# EAGLE design rs232 (EAGLE 6.6.0)
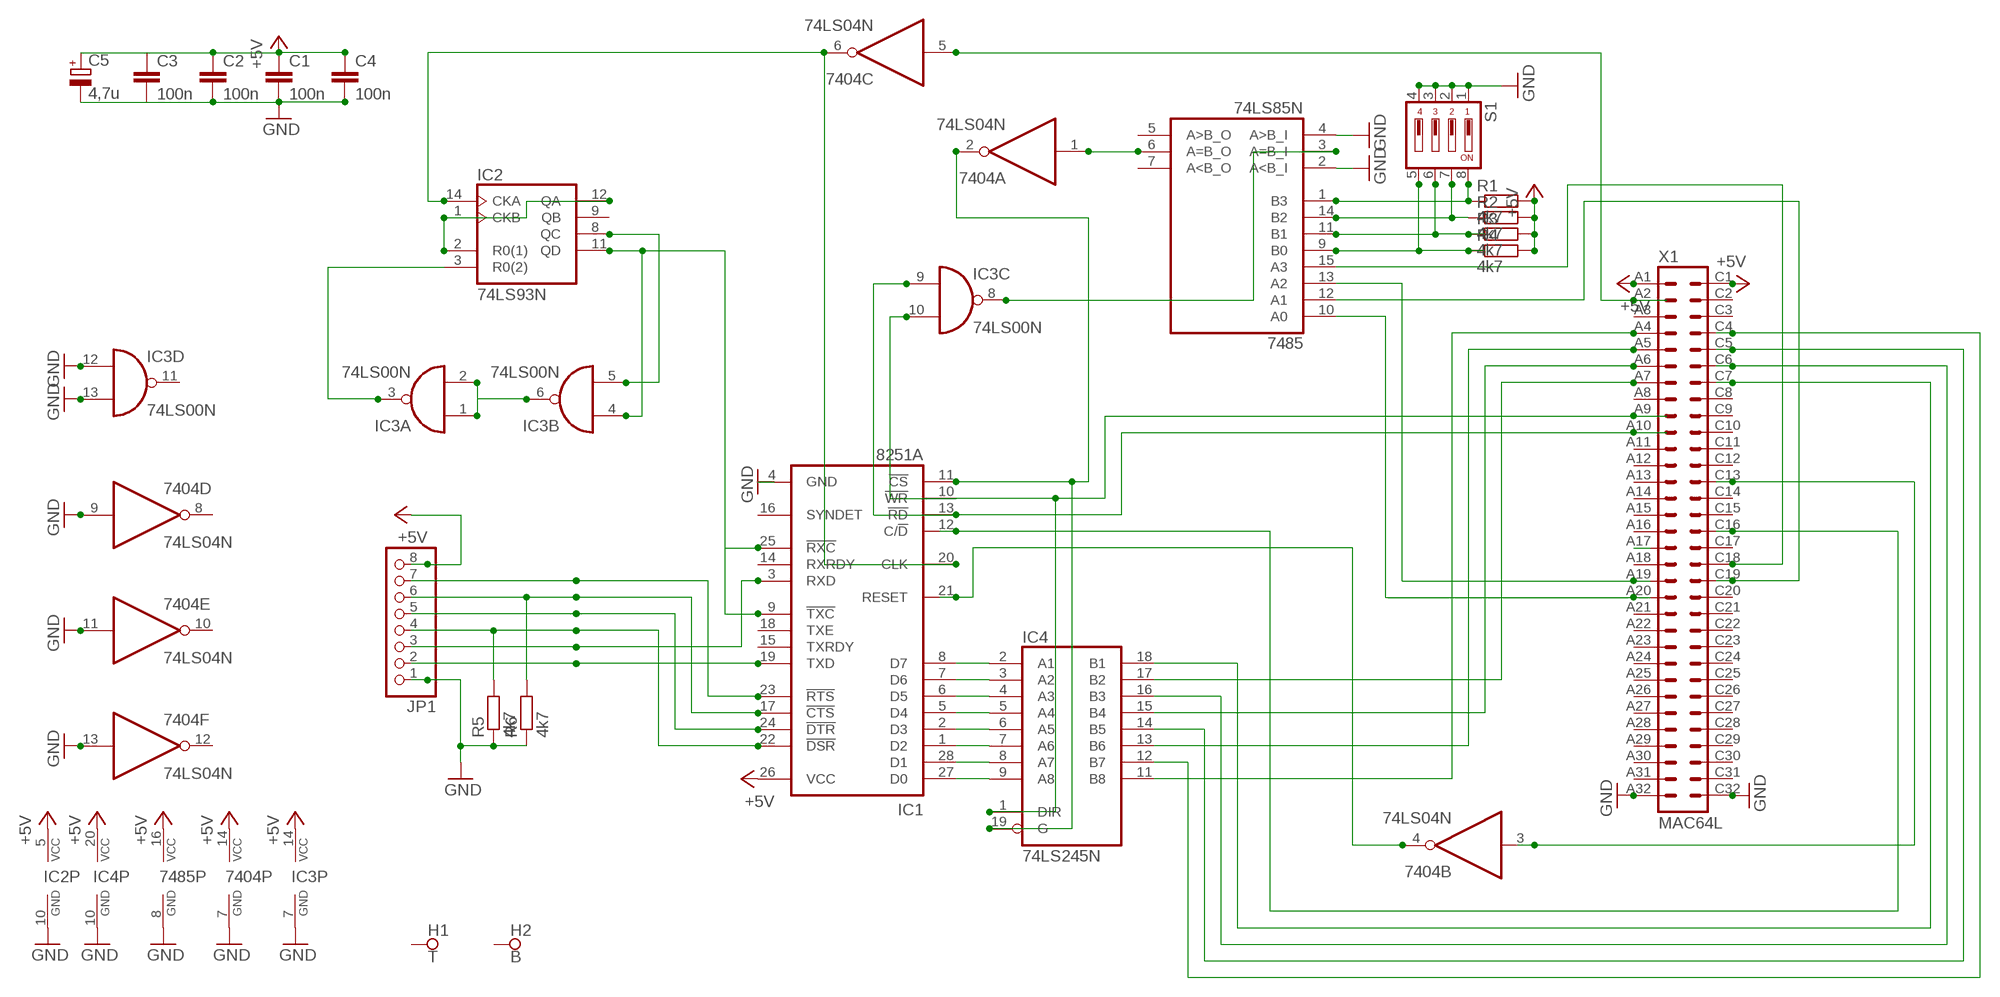
[diagram p0: schematic, sheet 1]

## Parts
7404  74LS04N  [DIL14]
7485  74LS85N  [DIL16]
C1  100n  C-EU025-025X050  [C025-025X050]
C2  100n  C-EU025-025X050  [C025-025X050]
C3  100n  C-EU025-025X050  [C025-025X050]
C4  100n  C-EU025-025X050  [C025-025X050]
C5  4,7u  CPOL-EUE2.5-5  [E2,5-5]
H1  T  SPECIAL_DRILL_0.1000  [PAD_0.1000]
H2  B  SPECIAL_DRILL_0.1000  [PAD_0.1000]
IC1  8251A  [DIL28-6]
IC2  74LS93N  [DIL14]
IC3  74LS00N  [DIL14]
IC4  74LS245N  [DIL20]
JP1  PINHD-1X8  [1X08]
R1  4k7  R-EU_0207/10  [0207/10]
R2  4k7  R-EU_0207/10  [0207/10]
R3  4k7  R-EU_0207/10  [0207/10]
R4  4k7  R-EU_0207/10  [0207/10]
R5  4k7  R-EU_0207/10  [0207/10]
R6  4k7  R-EU_0207/10  [0207/10]
S1  DS04  [DS-04]
X1  MAC64L  [MAC64L]

## Nets
+5V: 7404.14(P:VCC) 7485.16(VCC) C1.1 C2.1 C3.1 C4.1 C5.+ IC1.26(VCC) IC2.5(VCC) IC3.14(P:VCC) IC4.20(VCC) JP1.8 R1.2 R2.2 R3.2 R4.2 X1.A1 X1.C1
-A=B: 7485.3(A=B_I) IC3.8(C:O)
-CLK: 7404.6(C:O) IC1.20(CLK) IC2.14(CKA)
-D0: IC1.27(D0) IC4.9(A8)
-D1: IC1.28(D1) IC4.8(A7)
-D2: IC1.1(D2) IC4.7(A6)
-D3: IC1.2(D3) IC4.6(A5)
-D4: IC1.5(D4) IC4.5(A4)
-D5: IC1.6(D5) IC4.4(A3)
-D6: IC1.7(D6) IC4.3(A2)
-D7: IC1.8(D7) IC4.2(A1)
/CS: 7404.2(A:O) IC1.11(!CS) IC4.19(G)
/CTS: IC1.17(!CTS) JP1.6 R6.2
/DSR: IC1.22(!DSR) JP1.4 R5.2
/DTR: IC1.24(!DTR) JP1.5
/RES: 7404.3(B:I) X1.C13
/RTS: IC1.23(!RTS) JP1.7
A0: IC1.12(C/!D) X1.C16
A1: X1.A17
A4: 7485.15(A3) X1.C18
A5: 7485.13(A2) X1.A19
A6: 7485.12(A1) X1.C19
A7: 7485.10(A0) X1.A20
A=B: 7404.1(A:I) 7485.6(A=B_O)
CLK: 7404.5(C:I) X1.A2
D0: IC4.11(B8) X1.A4
D1: IC4.12(B7) X1.C4
D2: IC4.13(B6) X1.A5
D3: IC4.14(B5) X1.C5
D4: IC4.15(B4) X1.A6
D5: IC4.16(B3) X1.C6
D6: IC4.17(B2) X1.A7
D7: IC4.18(B1) X1.C7
GND: 7404.7(P:GND) 7404.9(D:I) 7404.11(E:I) 7404.13(F:I) 7485.2(A<B_I) 7485.4(A>B_I) 7485.8(GND) C1.2 C2.2 C3.2 C4.2 C5.- IC1.4(GND) IC2.10(GND) IC3.7(P:GND) IC3.12(D:I0) IC3.13(D:I1) IC4.10(GND) JP1.1 R5.1 R6.1 S1.1 S1.2 S1.3 S1.4 X1.A32 X1.C32
IOR: IC1.13(!RD) IC3.9(C:I0) X1.A10
IOW: IC1.10(!WR) IC3.10(C:I1) IC4.1(DIR) X1.A9
N$8: IC3.1(A:I0) IC3.2(A:I1) IC3.6(B:O)
N$9: IC2.3(R0(2)) IC3.3(A:O)
N$10: IC2.8(QC) IC3.5(B:I1)
N$19: IC2.1(CKB) IC2.2(R0(1)) IC2.12(QA)
R1: 7485.1(B3) R1.1 S1.8
R2: 7485.14(B2) R2.1 S1.7
R3: 7485.11(B1) R3.1 S1.6
R4: 7485.9(B0) R4.1 S1.5
RES: 7404.4(B:O) IC1.21(RESET)
RTXC: IC1.9(!TXC) IC1.25(!RXC) IC2.11(QD) IC3.4(B:I0)
RXD: IC1.3(RXD) JP1.3
TXD: IC1.19(TXD) JP1.2
Unconnected: 7404.8(D:O) 7404.10(E:O) 7404.12(F:O) 7485.5(A>B_O) 7485.7(A<B_O) H1.1 H2.1 IC1.14(RXRDY) IC1.15(TXRDY) IC1.16(SYNDET) IC1.18(TXE) IC2.9(QB) IC3.11(D:O) X1.A3 X1.A8 X1.A11 X1.A12 X1.A13 X1.A14 X1.A15 X1.A16 X1.A18 X1.A21 X1.A22 X1.A23 X1.A24 X1.A25 X1.A26 X1.A27 X1.A28 X1.A29 X1.A30 X1.A31 X1.C2 X1.C3 X1.C8 X1.C9 X1.C10 X1.C11 X1.C12 X1.C14 X1.C15 X1.C17 X1.C20 X1.C21 X1.C22 X1.C23 X1.C24 X1.C25 X1.C26 X1.C27 X1.C28 X1.C29 X1.C30 X1.C31

## Library data of the parts
7404 = 74xx-eu:74*04: Hex INVERTER
7485 = 74xx-eu:74*85: 4-bit magnitude COMPARATOR
C1-C4 = rcl:C-EU: CAPACITOR, European symbol
C5 = rcl:CPOL-EU: POLARIZED CAPACITOR, European symbol
H1 H2 = special-drill:SPECIAL_DRILL_: Special drills
IC1 = micro-intel:8251A: Universal Syncronous/Asynchronous Receiver/Transmitter (USART) Source: http://www.alldatasheet.com/datasheet-pdf/pdf/INTEL/8251A.html; OC_FARNELL: unknown; OC_NEWARK: unknown
IC2 = 74xx-eu:74*93: Decade, divide by twelve and binary COUNTER
IC3 = 74xx-eu:74*00: Quad 2-input NAND gate
IC4 = 74xx-eu:74*245: Octal BUS TRANSCEIVER, 3-state
JP1 = pinhead:PINHD-1X8: PIN HEADER
R1-R6 = rcl:R-EU_: RESISTOR, European symbol
S1 = switch-dil:DS04: DIL/CODE SWITCH; OC_FARNELL: 9471570; OC_NEWARK: unknown
X1 = con-vg:MAC64L: CONNECTOR male, 64 pins, block, type C, rows AC, grid 5.08 mm

## Board
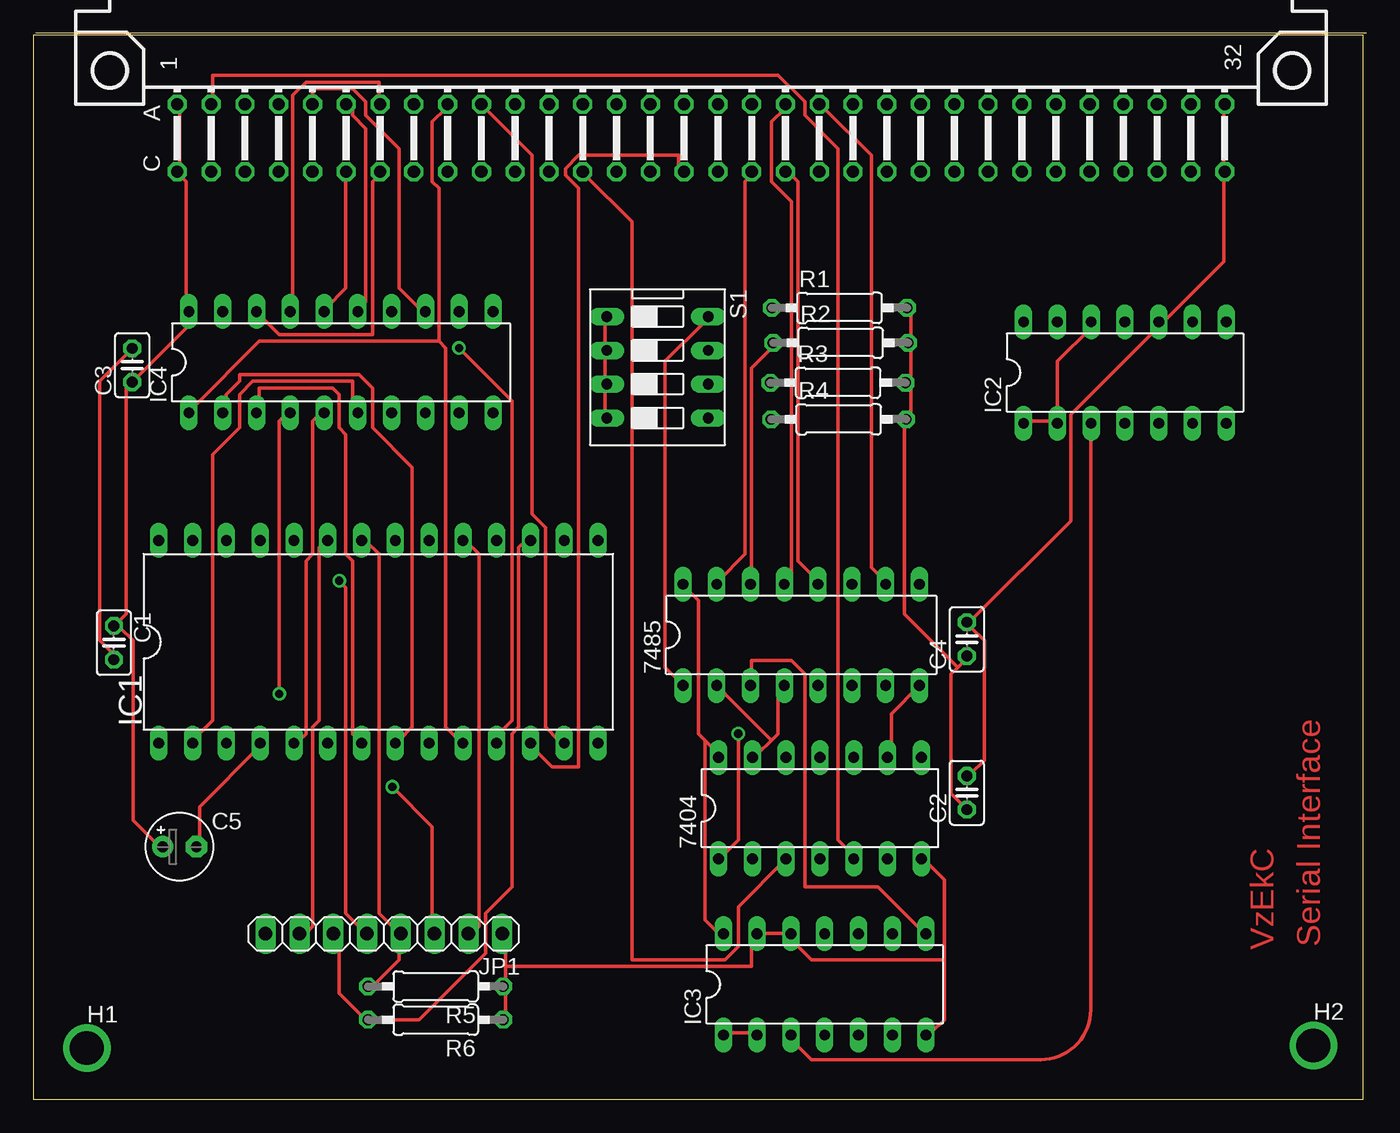
[diagram p1: board, top side]
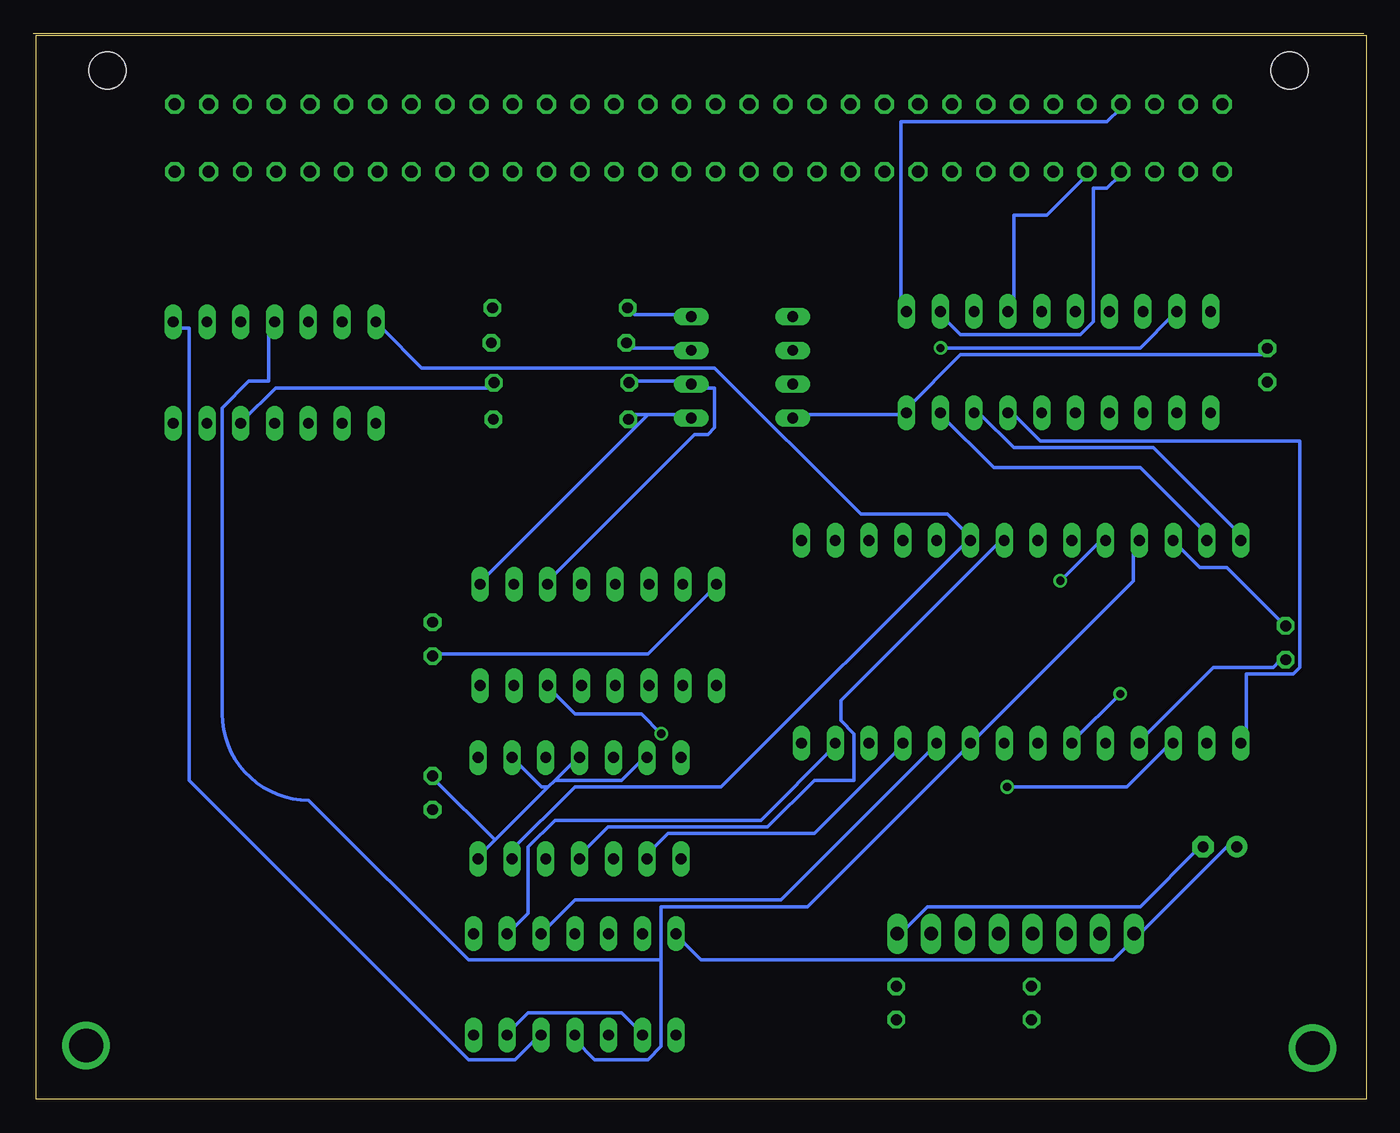
[diagram p2: board, bottom side, seen from below]

Size 100 x 80 mm. Coordinates in mm from the lower left corner, seen from the top.
Outline: 0,0 100,0 100,80 0,80 0,0
Copper layers (1*16): Top 0.035mm / dielectric 1.5mm / Bottom 0.035mm
Design rules "default": minimum track width 10mil, minimum drill 24mil, track to track 8mil, track to pad 8mil, pad to pad 8mil, via to via 8mil, smd to smd 8mil, copper to edge 40mil, drill to drill 8mil, minimum pad ring 10mil, minimum via ring 8mil, stop-mask expansion 4mil, vias tented up to drill 0mil, thermal gap 10mil

### Footprints (pad centres in the part's own frame; a part is rotated, then mirrored left to right if it is on the bottom)
DIL14 = drill 0.813 long: 1 -7.62,-3.81; 2 -5.08,-3.81; 3 -2.54,-3.81; 4 0,-3.81; 5 2.54,-3.81; 6 5.08,-3.81; 7 7.62,-3.81; 8 7.62,3.81; 9 5.08,3.81; 10 2.54,3.81; 11 0,3.81; 12 -2.54,3.81; 13 -5.08,3.81; 14 -7.62,3.81
DIL16 = drill 0.813 long: 1 -8.89,-3.81; 2 -6.35,-3.81; 3 -3.81,-3.81; 4 -1.27,-3.81; 5 1.27,-3.81; 6 3.81,-3.81; 7 6.35,-3.81; 8 8.89,-3.81; 9 8.89,3.81; 10 6.35,3.81; 11 3.81,3.81; 12 1.27,3.81; 13 -1.27,3.81; 14 -3.81,3.81; 15 -6.35,3.81; 16 -8.89,3.81
C025-025X050 = drill 0.813 octagon: 1 -1.27,0; 2 1.27,0
E2,5-5 = drill 0.813 pad 1.6: + -1.27,0 | drill 0.813 pad 1.6 octagon: - 1.27,0
PAD_0.1000 = drill 2.54 pad 2.54: 1 0,0
DIL28-6 = drill 0.813 long: 1 -16.51,-7.62; 2 -13.97,-7.62; 3 -11.43,-7.62; 4 -8.89,-7.62; 5 -6.35,-7.62; 6 -3.81,-7.62; 7 -1.27,-7.62; 8 1.27,-7.62; 9 3.81,-7.62; 10 6.35,-7.62; 11 8.89,-7.62; 12 11.43,-7.62; 13 13.97,-7.62; 14 16.51,-7.62; 15 16.51,7.62; 16 13.97,7.62; 17 11.43,7.62; 18 8.89,7.62; 19 6.35,7.62; 20 3.81,7.62; 21 1.27,7.62; 22 -1.27,7.62; 23 -3.81,7.62; 24 -6.35,7.62; 25 -8.89,7.62; 26 -11.43,7.62; 27 -13.97,7.62; 28 -16.51,7.62
DIL20 = drill 0.813 long: 1 -11.43,-3.81; 2 -8.89,-3.81; 3 -6.35,-3.81; 4 -3.81,-3.81; 5 -1.27,-3.81; 6 1.27,-3.81; 7 3.81,-3.81; 8 6.35,-3.81; 9 8.89,-3.81; 10 11.43,-3.81; 11 11.43,3.81; 12 8.89,3.81; 13 6.35,3.81; 14 3.81,3.81; 15 1.27,3.81; 16 -1.27,3.81; 17 -3.81,3.81; 18 -6.35,3.81; 19 -8.89,3.81; 20 -11.43,3.81
1X08 = drill 1.016 long: 1 -8.89,0; 2 -6.35,0; 3 -3.81,0; 4 -1.27,0; 5 1.27,0; 6 3.81,0; 7 6.35,0; 8 8.89,0
0207/10 = drill 0.813 octagon: 1 -5.08,0; 2 5.08,0
DS-04 = drill 0.813 long: 1 -3.81,-3.81; 2 -1.27,-3.81; 3 1.27,-3.81; 4 3.81,-3.81; 5 3.81,3.81; 6 1.27,3.81; 7 -1.27,3.81; 8 -3.81,3.81
MAC64L = drill 0.914 octagon: A1 -2.54,39.37; A2 -2.54,36.83; A3 -2.54,34.29; A4 -2.54,31.75; A5 -2.54,29.21; A6 -2.54,26.67; A7 -2.54,24.13; A8 -2.54,21.59; A9 -2.54,19.05; A10 -2.54,16.51; A11 -2.54,13.97; A12 -2.54,11.43; A13 -2.54,8.89; A14 -2.54,6.35; A15 -2.54,3.81; A16 -2.54,1.27; A17 -2.54,-1.27; A18 -2.54,-3.81; A19 -2.54,-6.35; A20 -2.54,-8.89; A21 -2.54,-11.43; A22 -2.54,-13.97; A23 -2.54,-16.51; A24 -2.54,-19.05; A25 -2.54,-21.59; A26 -2.54,-24.13; A27 -2.54,-26.67; A28 -2.54,-29.21; A29 -2.54,-31.75; A30 -2.54,-34.29; A31 -2.54,-36.83; A32 -2.54,-39.37; C1 -7.62,39.37; C2 -7.62,36.83; C3 -7.62,34.29; C4 -7.62,31.75; C5 -7.62,29.21; C6 -7.62,26.67; C7 -7.62,24.13; C8 -7.62,21.59; C9 -7.62,19.05; C10 -7.62,16.51; C11 -7.62,13.97; C12 -7.62,11.43; C13 -7.62,8.89; C14 -7.62,6.35; C15 -7.62,3.81; C16 -7.62,1.27; C17 -7.62,-1.27; C18 -7.62,-3.81; C19 -7.62,-6.35; C20 -7.62,-8.89; C21 -7.62,-11.43; C22 -7.62,-13.97; C23 -7.62,-16.51; C24 -7.62,-19.05; C25 -7.62,-21.59; C26 -7.62,-24.13; C27 -7.62,-26.67; C28 -7.62,-29.21; C29 -7.62,-31.75; C30 -7.62,-34.29; C31 -7.62,-36.83; C32 -7.62,-39.37 | hole 2.794: 0,44.45; 0,-44.45

### Placement (x,y rotation side)
7404  59.14,21.9 0 top
7485  57.73,34.93 0 top
C1  6.06,34.34 270 top
C2  70.19,23.06 90 top
C3  7.44,55.21 90 top
C4  70.19,34.61 90 top
C5  11,19 0 top
H1  4.03,3.86 0 top
H2  96.24,4.06 0 top
IC1  25.95,34.41 0 top
IC2  82.07,54.65 0 top
IC3  59.5,8.65 0 top
IC4  23.13,55.43 0 top
JP1  26.36,12.46 180 top
R1  60.61,59.52 0 top
R2  60.7,56.89 0 top
R3  60.5,53.89 0 top
R4  60.55,51.14 0 top
R5  30.25,8.5 180 top
R6  30.25,6 180 top
S1  46.93,55.05 270 top
X1  50.2,77.37 90 top

### Tracks (layer width: path | path; a pad name or v marks a point on that pad's centre or on a via)
+5V
  Top 0.254: X1.A1 11,74.5 11,70 X1.C1 11,69.5 11.5,69 11.5,59.5 IC4.20 11.5,59 11.5,58 C3.1 7,53.5 7,36.5 6.5,36 C1.1 6.5,35.5 7.5,34.5 7.5,21 9.5,19 C5.+ | 50.5,27 50,27.5 50,37.5 49,38.5 7485.16 | 50.5,27 51.5,26 7404.14 | 50.5,27 50.5,13.5 51.5,12.5 IC3.14 | 69.5,32.5 70,33 C4.1 | 69.5,32.5 69,32 69,23 70,22 C2.1 | R1.2 66,59.5 66,57 R2.2 66,56.5 66,54 R3.2 66,53.5 66,51.5 R4.2 65.5,51 65.5,36.5 69.5,32.5
  Bottom 0.254: C5.+ 10.5,19 17,12.5 JP1.8 17.5,12 19,10.5 50,10.5 51.5,12 IC3.14 | C1.1 6.5,36 10.5,40 12.5,40 14.5,42 IC1.26 | IC2.5 84.5,51 82,53.5 66,53.5 R3.2 | 7485.16 49,38.5 54,33.5 70,33.5 C4.1
-A=B
  Top 0.254: IC3.8 67,12.5 63.5,16 58,16 58,32 57,33 54,33 54,31.5 7485.3
-CLK
  Bottom 0.254: 7404.6 64.5,18.5 59.5,23.5 48.5,23.5 30,42 IC1.20 30,42.5 31.5,44 38,44 49,55 71,55 74,58 IC2.14
-D0
  Bottom 0.254: IC1.27 12,42.5 17,47.5 28,47.5 32,51.5 IC4.9
-D1
  Bottom 0.254: IC1.28 9.5,42.5 16,49 26.5,49 29,51.5 IC4.8
-D2
  Bottom 0.254: IC1.1 9,27 9,32 5.5,32 5,32.5 5,49.5 24.5,49.5 26.5,51.5 IC4.7
-D3
  Top 0.254: IC1.2 12,27 13.5,28.5 13.5,48.5 15.5,50.5 15.5,53 16.5,54 24,54 24,52 IC4.6
-D4
  Top 0.254: IC1.5 20,27 20.5,27.5 20.5,40.5 21,41 21,51 21.5,51.5 IC4.5
-D5  (via drill 0.61)
  Top 0.254: v18.5,30.5 18.5,51 19,51.5 IC4.4
  Bottom 0.254: v18.5,30.5 22,27 IC1.6
-D6
  Top 0.254: IC1.7 24.5,27 24,27.5 24,40.5 23.5,41 23.5,50 23,50.5 23,53 22.5,53.5 17,53.5 17,52 IC4.3
-D7
  Top 0.254: IC1.8 27.5,27 28.5,28 28.5,47.5 25.5,50.5 25.5,53.5 24.5,54.5 15.5,54.5 15.5,54 14.5,53 14.5,52 IC4.2
/CS  (via drill 0.61)
  Top 0.254: v32,56.5 36,52.5 36,28.5 35,27.5 35,27 IC1.11
  Bottom 0.254: IC1.11 35,26.5 41.5,20 52.5,20 54,18.5 7404.2 | v32,56.5 17,56.5 14.5,59 IC4.19
/CTS
  Top 0.254: JP1.6 23,12 23,8 25,6 R6.2 29,6 34,11 34,14 36,16 36,27.5 36.5,28 36.5,41.5 37,42 IC1.17
/DSR
  Top 0.254: R5.2 25.5,8.5 27.5,10.5 27.5,12 JP1.4 27.5,12.5 26,14 26,41 25,42 IC1.22
/DTR  (via drill 0.61)
  Top 0.254: v23,39 23.5,38.5 23.5,14 25,12.5 JP1.5
  Bottom 0.254: v23,39 20,42 IC1.24
/RES
  Top 0.254: 7404.3 56.5,18 53,14.5 53,11.5 52,10.5 45,10.5 45,66 41.5,69.5 X1.C13
/RTS
  Top 0.254: IC1.23 22,42 21.5,41.5 21.5,28.5 21,28 21,13 20.5,12.5 JP1.7
A0
  Top 0.254: IC1.12 37.5,26.5 39,25 41,25 41,68.5 40,69.5 40,70 41,71 48.5,71 48.5,70 X1.C16
A4
  Top 0.254: 7485.15 51.5,39 53.5,41 53.5,69 54,69.5 X1.C18
A5
  Top 0.254: 7485.13 56.5,39 57,39.5 57,67.5 55.5,69 55.5,73.5 56.5,74.5 X1.A19
A6
  Top 0.254: 7485.12 59,39 57.5,40.5 57.5,69 57,69.5 X1.C19
A7
  Top 0.254: 7485.10 64,39 63,40 63,71 59.5,74.5 X1.A20
A=B  (via drill 0.61)
  Top 0.254: v53,27.5 53,19.5 52,18.5 7404.1
  Bottom 0.254: v53,27.5 54.5,29 59.5,29 61.5,31 7485.6
CLK
  Top 0.254: 7404.5 61.5,18.5 60.5,19.5 60.5,71.5 58,74 58,75 56,77 13.5,77 13.5,75 X1.A2
D0
  Bottom 0.254: IC4.11 35,59.5 35,73.5 19.5,73.5 18.5,74.5 X1.A4
D1
  Bottom 0.254: IC4.12 32,59 30.5,57.5 21.5,57.5 20.5,58.5 20.5,68.5 19.5,68.5 18.5,69.5 X1.C4
D2
  Top 0.254: IC4.13 29,59.5 27.5,61 27.5,71.5 25,74 25,75 24,76 21,76 21,75 X1.A5
D3
  Bottom 0.254: IC4.14 26.5,59.5 26.5,66.5 24,66.5 21,69.5 X1.C5
D4
  Top 0.254: IC4.15 24.5,59.5 25,60 25,73 24,74 24,74.5 X1.A6
D5
  Top 0.254: IC4.16 22,59.5 23.5,61 23.5,69.5 X1.C6
D6
  Top 0.254: IC4.17 19.5,59.5 19.5,75.5 20.5,76.5 26,76.5 26,75 X1.A7
D7
  Top 0.254: IC4.18 17,59 18.5,57.5 25.5,57.5 25.5,69 26,69.5 X1.C7
GND
  Top 0.254: S1.1 43,58.5 43,56.5 S1.2 43,56 43,54 S1.3 43,53.5 43,51.5 S1.4 | IC1.4 17,26.5 12.5,22 12.5,19 C5.- | C3.2 7,56 5,54 5,34.5 6,33.5 C1.2 | X1.A32 89.5,74.5 89.5,70 X1.C32 89.5,69.5 89.5,63 85,58.5 IC2.10 84.5,58 78,51.5 78,43.5 70.5,36 C4.2 70.5,35.5 71.5,34.5 71.5,25.5 70.5,24.5 C2.2 | 55.5,27 56,27.5 56,31 7485.4 | 55.5,27 54.5,26 7404.13 | 55.5,27 7485.2 | 35.5,8.5 35.5,6 R6.1 | 35.5,8.5 35.5,10 | 35.5,10 35.5,12 JP1.1 | 35.5,8.5 R5.1 | 68.5,10.5 68.5,16.5 67,18 7404.7 | 68.5,10.5 68.5,6 67.5,5 IC3.7 | 7485.8 64.5,29 64.5,26 7404.9 | 68.5,10.5 58.5,10.5 57,12 IC3.12 56.5,12.5 54.5,12.5 IC3.13 54,12 54,10 35.5,10
  Bottom 0.254: S1.4 43,51.5 35,51.5 IC4.10 34.5,52 30.5,56 7.5,56 C3.2 | C1.2 6.5,33 7,32.5 11.5,32.5 17,27 IC1.4 | 65.5,19.5 66.5,18.5 7404.7 | 65.5,19.5 61.5,23.5 | 61.5,23.5 61,24 | 61,24 59.5,25.5 7404.11 | 61.5,23.5 62,23.5 64,25.5 7404.9 | 65.5,19.5 70,24 C2.2 | 61,24 56,24 54.5,25.5 7404.13 | C5.- 12.5,19 17,14.5 33,14.5 35,12.5 JP1.1
IOR
  Top 0.254: X1.A10 34,74.5 37.5,71 37.5,44 38.5,43 38.5,28 39.5,27 IC1.13
  Bottom 0.254: IC1.13 40,26.5 45.5,21 61,21 63,19 63,14 64.5,12.5 IC3.9
IOW
  Top 0.254: 30.5,57 17,57 12,52 IC4.1 | 30.5,57 30.5,68.5 30,69 30,73.5 31,74.5 X1.A9 | 30.5,57 31,56.5 31,28 32,27 IC1.10
  Bottom 0.254: IC3.10 59.5,15 44,15 32.5,26.5 IC1.10
N$8
  Top 0.254: IC3.1 52,5 54,5 IC3.2
  Bottom 0.254: IC3.6 64.5,5 63,6.5 56,6.5 54.5,5 IC3.2
N$9
  Top 0.254: IC3.3 57,4.5 58.5,3 75.75,3 arc90 79.5,6.75 79.5,50.5 IC2.3
N$10
  Bottom 0.254: IC3.5 62.5,4.5 64,3 67.5,3 88.5,24 88.5,58 89.5,58 IC2.8
N$19
  Top 0.254: IC2.1 74.5,51 76.5,51 IC2.2 77,51 77,55.5 79.5,58 IC2.12
R1
  Top 0.254: 7485.1 48.5,31.5 47.5,32.5 47.5,55.5 50.5,58.5 S1.8
  Bottom 0.254: R1.1 55.5,59.5 55,59 51,59 S1.8
R2
  Top 0.254: 7485.14 54,39 54,55 55.5,56.5 R2.1
  Bottom 0.254: S1.7 51,56.5 55.5,56.5 R2.1
R3
  Bottom 0.254: R3.1 55,54 51,54 S1.6 50.5,53.5 49,53.5 49,50.5 49.5,50 50.5,50 61.5,39 7485.11
R4
  Bottom 0.254: 54,51.5 51,51.5 S1.5 | 54,51.5 55,51.5 R4.1 | 54,51.5 66.5,39 7485.9
RES
  Bottom 0.254: IC1.21 27.5,42 39.5,30 39.5,28.5 38.5,27.5 38.5,24 41.5,24 45,20.5 57,20.5 59,18.5 7404.4
RTXC
  Bottom 0.254: IC1.25 17.5,42 17.5,39 29.5,27 IC1.9 30,26.5 42,14.5 53,14.5 53,10.5 | 53,10.5 53,4 54,3 58,3 59.5,4.5 IC3.4 | 53,10.5 67.5,10.5 79.5,22.5 arc90 86,29 86,52 84,54 82.5,54 82.5,58 IC2.11
RXD  (via drill 0.61)
  Top 0.254: v27,23.5 30,20.5 30,12.5 JP1.3
  Bottom 0.254: v27,23.5 18,23.5 15,26.5 IC1.3
TXD
  Top 0.254: IC1.19 32.5,42 33.5,41 33.5,13 33,12.5 JP1.2

### Text on the board
Top: Serial Interface | VzEkC